# EAGLE board Pulsar 1.8 (EAGLE 5.11)
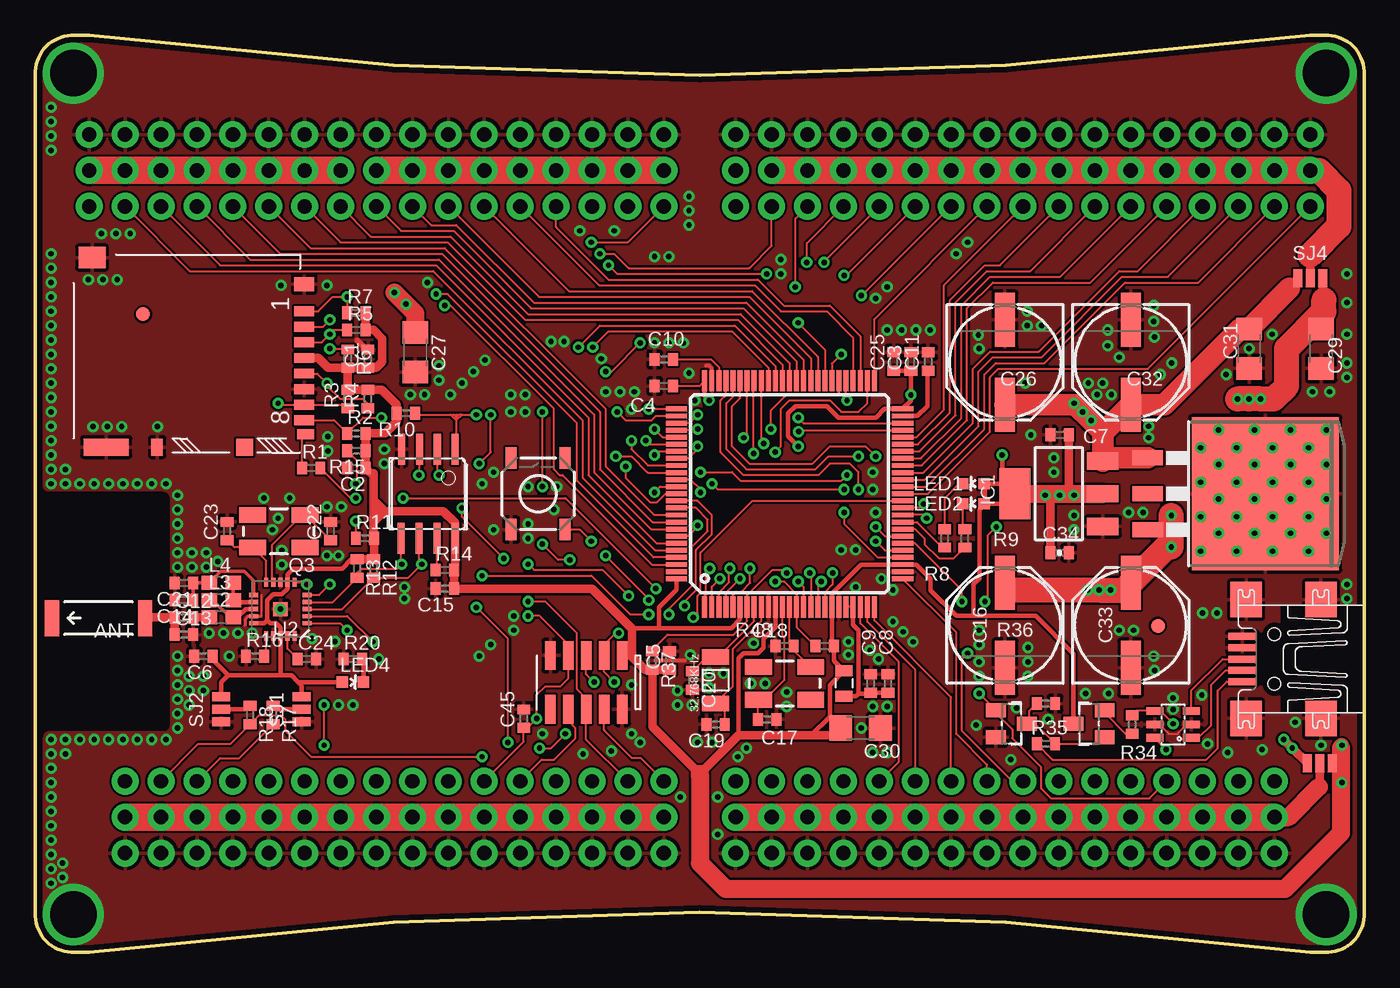
[diagram p6: board, top side]
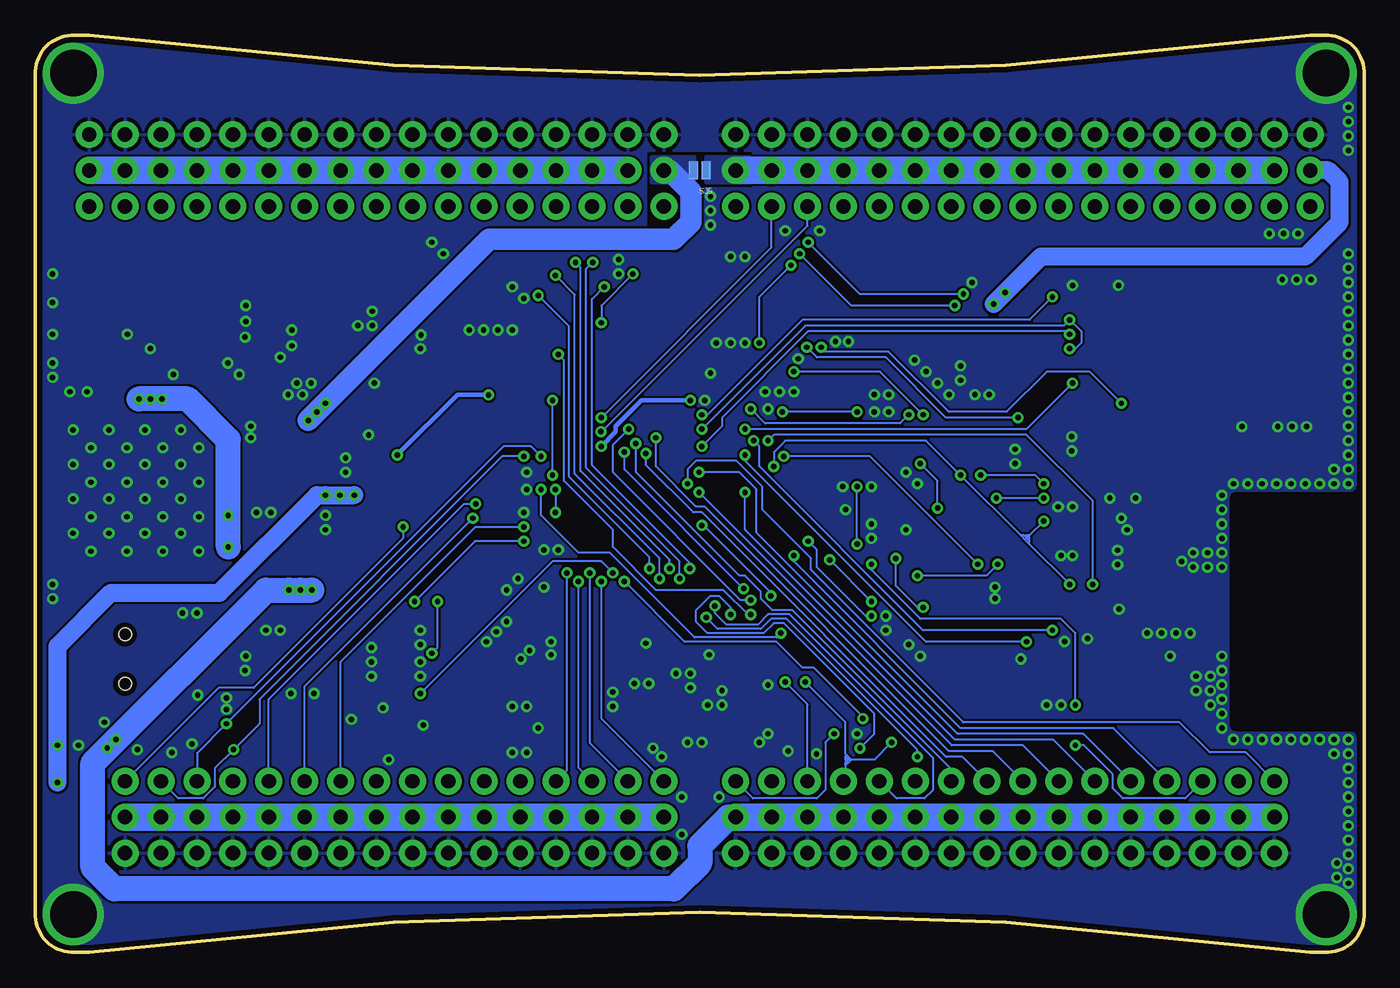
[diagram p7: board, bottom side, seen from below]

Size 93.98 x 64.82 mm. Coordinates in mm from the lower left corner, seen from the top.
Outline: 0,62.28 0,2.54 arc85 2.54,0 3.81,0 arc-15 90.17,0 91.44,0 arc85 93.98,2.54 93.98,62.28 arc85 91.44,64.82 90.17,64.82 arc-15 3.81,64.82 2.54,64.82 arc85 0,62.28
Copper layers (1*16): Top 0.035mm / dielectric 1.5mm / Bottom 0.035mm
Design rules "PDX (Production)": minimum track width 6mil, minimum drill 15mil, track to track 6mil, track to pad 6mil, pad to pad 4mil, via to via 6mil, smd to smd 4mil, copper to edge 15mil, drill to drill 6mil, minimum pad ring 10mil, minimum via ring 8mil, stop-mask expansion 4mil, vias tented up to drill 25mil, thermal gap 10mil
tRestrict: 7 lines
bRestrict: 10 lines

## Footprints (pad centres in the part's own frame; a part is rotated, then mirrored left to right if it is on the bottom)
ANTENNA-CHIP5 = smd 1.016 x 2.54: FEED -3.302,0; NC 3.302,0
C0402 = smd 0.7 x 0.9: 1 -0.65,0; 2 0.65,0
PANASONIC_E = smd 3.8 x 1.4: + 3,0; - -3,0
1206 = smd 1.6 x 1.8: 1 -1.4,0; 2 1.4,0
0402-CAP = smd 0.7 x 0.9: 1 -0.65,0; 2 0.65,0
#PULSAR-PTH = drill 1.016 pad 1.905 round: 5V1 -87.63,-55.88; 5V2 -85.09,-55.88; 5V3 -82.55,-55.88; 5V4 -80.01,-55.88; 5V5 -77.47,-55.88; 5V6 -74.93,-55.88; 5V7 -72.39,-55.88; 5V8 -69.85,-55.88; 5V9 -67.31,-55.88; 5V10 -64.77,-55.88; 5V11 -62.23,-55.88; 5V12 -59.69,-55.88; 5V13 -57.15,-55.88; 5V14 -54.61,-55.88; 5V15 -52.07,-55.88; 5V16 -49.53,-55.88; 5V/3.3V1 -44.45,-55.88; 5V/3.3V2 -41.91,-55.88; 5V/3.3V3 -39.37,-55.88; 5V/3.3V4 -36.83,-55.88; 5V/3.3V5 -34.29,-55.88; 5V/3.3V6 -31.75,-55.88; 5V/3.3V7 -29.21,-55.88; 5V/3.3V8 -26.67,-55.88; 5V/3.3V9 -24.13,-55.88; 5V/3.3V10 -21.59,-55.88; 5V/3.3V11 -19.05,-55.88; 5V/3.3V12 -16.51,-55.88; 5V/3.3V13 -13.97,-55.88; 5V/3.3V14 -11.43,-55.88; 5V/3.3V15 -8.89,-55.88; 5V/3.3V16 -6.35,-55.88; BOOT0 -82.55,-53.34; BOOT1 -85.09,-53.34; D0 -49.53,-12.7; D1 -41.91,-12.7; D2 -39.37,-12.7; D3 -36.83,-12.7; D4 -34.29,-12.7; D5 -31.75,-12.7; D6 -29.21,-12.7; D7 -26.67,-12.7; D8 -24.13,-12.7; D9 -21.59,-12.7; D10 -19.05,-12.7; D11 -16.51,-12.7; D12 -13.97,-12.7; D13 -11.43,-12.7; D14 -8.89,-12.7; D15 -6.35,-12.7; D16 -3.81,-12.7; D+ -11.43,-53.34; D- -8.89,-53.34; DAC1 -87.63,-53.34; DAC2 -6.35,-53.34; GND1 -87.63,-58.42; GND2 -85.09,-58.42; GND3 -82.55,-58.42; GND4 -80.01,-58.42; GND5 -77.47,-58.42; GND6 -74.93,-58.42; GND7 -72.39,-58.42; GND8 -69.85,-58.42; GND9 -67.31,-58.42; GND10 -64.77,-58.42; GND11 -62.23,-58.42; GND12 -59.69,-58.42; GND13 -57.15,-58.42; GND14 -54.61,-58.42; GND15 -52.07,-58.42; GND16 -49.53,-58.42; GND17 -44.45,-58.42; GND18 -41.91,-58.42; GND19 -39.37,-58.42; GND20 -36.83,-58.42; GND21 -34.29,-58.42; GND22 -31.75,-58.42; GND23 -29.21,-58.42; GND24 -26.67,-58.42; GND25 -24.13,-58.42; GND26 -21.59,-58.42; GND27 -19.05,-58.42; GND28 -16.51,-58.42; GND29 -13.97,-58.42; GND30 -11.43,-58.42; GND31 -8.89,-58.42; GND32 -6.35,-58.42; GND33 -3.81,-7.62; GND34 -6.35,-7.62; GND35 -8.89,-7.62; GND36 -11.43,-7.62; GND37 -13.97,-7.62; GND38 -16.51,-7.62; GND39 -19.05,-7.62; GND40 -21.59,-7.62; GND41 -24.13,-7.62; GND42 -26.67,-7.62; GND43 -29.21,-7.62; GND44 -31.75,-7.62; GND45 -34.29,-7.62; GND46 -36.83,-7.62; GND47 -39.37,-7.62; GND48 -41.91,-7.62; GND49 -44.45,-7.62; GND50 -49.53,-7.62; GND51 -52.07,-7.62; GND52 -54.61,-7.62; GND53 -57.15,-7.62; GND54 -59.69,-7.62; GND55 -62.23,-7.62; GND56 -64.77,-7.62; GND57 -67.31,-7.62; GND58 -69.85,-7.62; GND59 -72.39,-7.62; GND60 -74.93,-7.62; GND61 -77.47,-7.62; GND62 -80.01,-7.62; GND63 -82.55,-7.62; GND64 -85.09,-7.62; GND65 -87.63,-7.62; GND66 -90.17,-7.62; JTCK -57.15,-53.34; JTDI -52.07,-53.34; JTDO -59.69,-53.34; JTMS -54.61,-53.34; JTRST -49.53,-53.34; MCO -64.77,-53.34; NULL1 -44.45,-12.7; NULL2 -90.17,-12.7; PWR1 -44.45,-10.16; PWR2 -90.17,-10.16; RX1 -69.85,-53.34; RX2 -74.93,-53.34; RX3 -80.01,-53.34; SA -62.23,-53.34; T0 -87.63,-12.7; T1 -85.09,-12.7; T2 -82.55,-12.7; T3 -80.01,-12.7; T4 -77.47,-12.7; T5 -74.93,-12.7; T6 -72.39,-12.7; T7 -69.85,-12.7; T8 -67.31,-12.7; T9 -64.77,-12.7; T10 -62.23,-12.7; T11 -59.69,-12.7; T12 -57.15,-12.7; T13 -54.61,-12.7; T14 -52.07,-12.7; TA0 -16.51,-53.34; TA1 -19.05,-53.34; TA2 -21.59,-53.34; TA3 -24.13,-53.34; TA4 -26.67,-53.34; TA5 -29.21,-53.34; TA6 -31.75,-53.34; TA7 -34.29,-53.34; TA8 -36.83,-53.34; TA9 -39.37,-53.34; TA10 -41.91,-53.34; TA11 -44.45,-53.34; TX1 -67.31,-53.34; TX2 -72.39,-53.34; TX3 -77.47,-53.34; USBDISC -13.97,-53.34; VIN1 -49.53,-10.16; VIN2 -52.07,-10.16; VIN3 -54.61,-10.16; VIN4 -57.15,-10.16; VIN5 -59.69,-10.16; VIN6 -62.23,-10.16; VIN7 -64.77,-10.16; VIN8 -67.31,-10.16; VIN9 -69.85,-10.16; VIN10 -72.39,-10.16; VIN11 -74.93,-10.16; VIN12 -77.47,-10.16; VIN13 -80.01,-10.16; VIN14 -82.55,-10.16; VIN15 -85.09,-10.16; VIN16 -87.63,-10.16; VIN/5V1 -3.81,-10.16; VIN/5V2 -6.35,-10.16; VIN/5V3 -8.89,-10.16; VIN/5V4 -11.43,-10.16; VIN/5V5 -13.97,-10.16; VIN/5V6 -16.51,-10.16; VIN/5V7 -19.05,-10.16; VIN/5V8 -21.59,-10.16; VIN/5V9 -24.13,-10.16; VIN/5V10 -26.67,-10.16; VIN/5V11 -29.21,-10.16; VIN/5V12 -31.75,-10.16; VIN/5V13 -34.29,-10.16; VIN/5V14 -36.83,-10.16; VIN/5V15 -39.37,-10.16; VIN/5V16 -41.91,-10.16
SOT223 = smd 1.219 x 2.235: 1 -2.311,-3.099; 2 0,-3.099; 3 2.311,-3.099 | smd 3.6 x 2.2: 4 0,3.099
TO263-3 = smd 1.067 x 2.159: 1 -2.54,-5.791; 2 0,-5.791; 3 2.54,-5.791 | smd 10.8 x 10.41: TAB 0,2.54
FIDUCIAL-1X2 = smd 1 x 1: 1 0,0
0805 = smd 0.8 x 1.2: 1 -0.9,0; 2 0.9,0
0603 = smd 1.1 x 1: 1 -0.85,0; 2 0.85,0
LED-0603 = smd 0.8 x 0.8: A 0,-0.75; C 0,0.75
CRYSTAL-SMD-5X3 = smd 1.9 x 1.1: 1 -1.85,-1.15; 2 1.85,-1.15; 3 1.85,1.15; 4 -1.85,1.15
CM415 = smd 1.1 x 1.9: P$1 0,0; P$2 3.3,0
R0402 = smd 0.7 x 0.9: 1 -0.65,0; 2 0.65,0
TACTILE_SWITCH_SMD = smd 1.524 x 0.762: 1 -2.54,1.905; 2 2.54,1.905; 3 -2.54,-1.905; 4 2.54,-1.905
SJ_3 = smd 0.635 x 1.27: 1 -0.889,0; 2 0,0; 3 0.889,0
SJ_3_PASTE1&2 = smd 0.635 x 1.27: 1 -0.889,0; 2 0,0; 3 0.889,0
SJ_2S-NO = smd 0.635 x 1.27: 1 -0.45,0; 2 0.45,0
TQFP100 = smd 1.5 x 0.35: 1 -8,6; 2 -8,5.5; 3 -8,5; 4 -8,4.5; 5 -8,4; 6 -8,3.5; 7 -8,3; 8 -8,2.5; 9 -8,2; 10 -8,1.5; 11 -8,1; 12 -8,0.5; 13 -8,0; 14 -8,-0.5; 15 -8,-1; 16 -8,-1.5; 17 -8,-2; 18 -8,-2.5; 19 -8,-3; 20 -8,-3.5; 21 -8,-4; 22 -8,-4.5; 23 -8,-5; 24 -8,-5.5; 25 -8,-6; 51 8,-6; 52 8,-5.5; 53 8,-5; 54 8,-4.5; 55 8,-4; 56 8,-3.5; 57 8,-3; 58 8,-2.5; 59 8,-2; 60 8,-1.5; 61 8,-1; 62 8,-0.5; 63 8,0; 64 8,0.5; 65 8,1; 66 8,1.5; 67 8,2; 68 8,2.5; 69 8,3; 70 8,3.5; 71 8,4; 72 8,4.5; 73 8,5; 74 8,5.5; 75 8,6 | smd 0.35 x 1.5: 26 -6,-8; 27 -5.5,-8; 28 -5,-8; 29 -4.5,-8; 30 -4,-8; 31 -3.5,-8; 32 -3,-8; 33 -2.5,-8; 34 -2,-8; 35 -1.5,-8; 36 -1,-8; 37 -0.5,-8; 38 0,-8; 39 0.5,-8; 40 1,-8; 41 1.5,-8; 42 2,-8; 43 2.5,-8; 44 3,-8; 45 3.5,-8; 46 4,-8; 47 4.5,-8; 48 5,-8; 49 5.5,-8; 50 6,-8; 76 6,8; 77 5.5,8; 78 5,8; 79 4.5,8; 80 4,8; 81 3.5,8; 82 3,8; 83 2.5,8; 84 2,8; 85 1.5,8; 86 1,8; 87 0.5,8; 88 0,8; 89 -0.5,8; 90 -1,8; 91 -1.5,8; 92 -2,8; 93 -2.5,8; 94 -3,8; 95 -3.5,8; 96 -4,8; 97 -4.5,8; 98 -5,8; 99 -5.5,8; 100 -6,8
QFN20 = smd 1 x 1: 0 0,0 | smd 0.65 x 0.3: 1 -1.9,1; 2 -1.9,0.5; 3 -1.9,0; 4 -1.9,-0.5; 5 -1.9,-1; 11 1.9,-1; 12 1.9,-0.5; 13 1.9,0; 14 1.9,0.5; 15 1.9,1 | smd 0.3 x 0.65: 6 -1,-1.9; 7 -0.5,-1.9; 8 0,-1.9; 9 0.5,-1.9; 10 1,-1.9; 16 1,1.9; 17 0.5,1.9; 18 0,1.9; 19 -0.5,1.9; 20 -1,1.9
DUBLIB_SOIC8 = smd 0.5 x 2.2: 1 -1.905,-3.154; 2 -0.645,-3.154; 3 0.625,-3.154; 4 1.895,-3.154; 5 1.905,3.154; 6 0.635,3.154; 7 -0.635,3.154; 8 -1.905,3.154
SOT23-6L = smd 0.55 x 1.2: 1 -0.95,-1.3; 2 0,-1.3; 3 0.95,-1.3; 4 0.95,1.3; 5 0,1.3; 6 -0.95,1.3
STM32-JTAG-10P = smd 0.762 x 2.032: 1 0,0; 2 0,3.81; 3 1.27,0; 4 1.27,3.81; 5 2.54,0; 6 2.54,3.81; 7 3.81,0; 8 3.81,3.81; 9 5.08,0; 10 5.08,3.81
HIROSE-SDCARD-DM3B-DSF-PEJ@1 = smd 0.7 x 1.4: P$1 0,-0.7; P$2 1.1,-0.7; P$3 2.2,-0.7; P$4 3.3,-0.7; P$5 4.4,-0.7; P$6 5.5,-0.7; P$7 6.6,-0.7; P$8 7.7,-0.7 | smd 0.7 x 1.2: P$9 8.7,-0.6 | smd 1.2 x 1.2: P$10 9.6,-4.9 | smd 1.2 x 0.8: P$11 9.6,-11.1 | smd 1.2 x 3.2: P$12 9.6,-14.7 | smd 1.5 x 1.9: P$13 -3.8,-15.7 | smd 1 x 1.4: P$14 -1.9,-0.7
SOT23@1 = smd 1 x 1.4: 1 -0.95,-1.1; 2 0.95,-1.1; 3 0,1.1
DUBLIB_UX60-MB-5ST = smd 2 x 0.5: 1 2.25,1.6; 2 2.25,0.8; 3 2.25,0; 4 2.25,-0.8; 5 2.25,-1.6 | smd 2.2 x 2.5: M1 -3.3,-4.2; M2 -3.3,4.2; M3 2,4.2; M4 2,-4.2 | hole 0.9: 0,-1.75; 0,1.75

## Placement (x,y rotation side)
ANT  ANTENNA2SMD5  [ANTENNA-CHIP5]  4.47,23.62 180 top
C1  0.1uF  [C0402]  23.52,41.96 90 top
C2  0.1uF  [C0402]  22.71,34.24 180 top
C3  0.1uF  [C0402]  61.93,41.76 90 top
C4  0.1uF  [C0402]  44.45,40.03 180 top
C5  0.1uF  [C0402]  44.86,20.62 90 top
C6  0.1uF  [C0402]  11.89,20.93 180 top
C7  0.1uF  [C0402]  72.44,36.58 180 top
C8  220pF  [C0402]  60.3,19 90 top
C9  0.1uF  [C0402]  59.08,19 90 top
C10  2.2uF  [C0402]  44.45,41.91 180 top
C11  2.2uF  [C0402]  63.14,41.76 90 top
C12  1.5pF  [C0402]  10.52,23.67 0 top
C13  1pF  [C0402]  10.52,22.45 0 top
C14  4.7pF  [C0402]  10.52,24.89 180 top
C15  0.1uF  [C0402]  28.96,25.7 180 top
C16  300uF  [PANASONIC_E]  68.58,23.11 90 top
C17  12.5pF  [C0402]  51.77,16.46 0 top
C18  12.5pF  [C0402]  52.98,21.64 180 top
C19  18pF  [C0402]  48.11,16.1 180 top
C20  18pF  [C0402]  46.48,19.2 270 top
C21  0.0022uF  [C0402]  10.52,26.11 180 top
C22  12.5pF  [C0402]  20.88,29.77 90 top
C23  12.5pF  [C0402]  13.56,29.77 90 top
C24  0.033uF  [C0402]  19.2,20.73 0 top
C25  0.1uF  [C0402]  60.71,41.76 90 top
C26  300uF  [PANASONIC_E]  68.58,41.71 270 top
C27  47uF  [1206]  26.87,42.42 270 top
C29  10uF  [1206]  90.93,42.67 270 top
C30  10uF  [1206]  58.37,15.85 0 top
C31  10uF  [1206]  85.85,42.67 90 top
C32  300uF  [PANASONIC_E]  77.47,41.71 270 top
C33  300uF  [PANASONIC_E]  77.47,23.11 90 top
C34  .1uF  [0402-CAP]  72.44,28.24 0 top
C45  220pF  [C0402]  34.54,16.51 90 top
FP1  #PULSARPTH  [#PULSAR-PTH]  93.98,65.43 0 top
IC1  3.3v  [SOT223]  72.39,32.41 90 top
IC3  LM340S-12  [TO263-3]  84.45,32.41 270 top
INFO12  Evan Teitelman and Warren D Greenway  [%CC-BY-SA]  -2.54,-10.77 0 top  (outside the outline)
JP1  FIDUCIAL1X2  [FIDUCIAL-1X2]  7.62,45.11 0 top
JP2  FIDUCIAL1X2  [FIDUCIAL-1X2]  79.4,23.06 0 top
L1  10uH  [0805]  57.2,19 270 top
L2  3.9nH  [0603]  13.16,23.67 0 top
L3  8.2nH  [0603]  13.16,24.89 0 top
L4  2.7nH  [0603]  13.16,26.11 0 top
LED1  [LED-0603]  66.34,33.12 90 top
LED2  [LED-0603]  66.34,31.7 90 top
LED4  [LED-0603]  22.45,19.1 270 top
LOGO1  #LOGOA-THICK  [#LOGOA-THICK]  64.77,33.68 0 bottom
PULSARPART1  #PULSAR-PARTLABELS-BOTTOM  [#PULSAR-LABELS-BOTT]  93.98,65.43 0 top
Q1  8MHz  [CRYSTAL-SMD-5X3]  52.98,19 0 top
Q2  CM415  [CM415]  48.11,17.58 90 top
Q3  16MHz  [CRYSTAL-SMD-5X3]  17.22,29.77 180 top
R1  10K  [R0402]  19.51,34.24 0 top
R2  47K  [R0402]  22.71,36.68 0 top
R3  47K  [R0402]  22.1,39.12 90 top
R4  47K  [R0402]  23.52,39.12 90 top
R5  47K  [R0402]  22.71,43.99 0 top
R6  47K  [R0402]  22.1,41.96 270 top
R7  47K  [R0402]  22.71,45.21 0 top
R8  330  [R0402]  64.31,29.26 90 top
R9  330  [R0402]  65.74,29.26 90 top
R10  47K  [R0402]  26.21,38.1 180 top
R11  47K  [R0402]  23.32,29.26 0 top
R12  47K  [R0402]  23.93,27.13 270 top
R13  47K  [R0402]  22.76,27.13 270 top
R14  47K  [R0402]  28.96,27.03 0 top
R15  47K  [R0402]  22.71,35.46 180 top
R16  22K  [R0402]  15.54,20.93 0 top
R17  47K  [R0402]  16.81,16.76 270 top
R18  47K  [R0402]  15.19,16.76 270 top
R20  330  [R0402]  22.45,20.73 0 top
R34  1.5K  [R0402]  77.57,16.1 90 top
R35  10K  [R0402]  71.48,14.73 0 top
R36  36K  [R0402]  71.48,17.58 0 top
R37  47K  [R0402]  43.64,20.62 270 top
R48  100K  [R0402]  55.83,21.64 0 top
RSTSWITCH  SWITCH-MOMENTARY-2SMD  [TACTILE_SWITCH_SMD]  35.56,32.41 90 top
SJ1  [SJ_3]  18.85,17.17 90 top
SJ2  [SJ_3]  13.16,17.17 90 top
SJ3  [SJ_3_PASTE1&2]  90.83,13.36 180 top
SJ4  [SJ_3_PASTE1&2]  90.17,47.65 0 top
SJ5  SOLDERJUMPERNO  [SJ_2S-NO]  46.99,55.27 180 bottom
U1  STM32F205VG  [TQFP100]  53.34,32.41 90 top
U2  NRF24L01SMD  [QFN20]  17.33,24.26 180 top
U3  SST25VF080B  [DUBLIB_SOIC8]  27.79,32.41 180 top
U4  USBLC6-2  [SOT23-6L]  80.47,16.1 90 top
U5  STM32-JTAG-10P  [STM32-JTAG-10P]  41.5,20.98 180 top
U6  HIROSE-SDCARD-DM3B-DSF-PEJ  [HIROSE-SDCARD-DM3B-DSF-PEJ@1]  19.71,45.31 270 top
U$23  PMBT6428  [SOT23@1]  74.52,16.15 90 top
U$24  PMBT6428  [SOT23@1]  69.04,16.15 270 top
X2  MINI-USBUX60-MB-5ST  [DUBLIB_UX60-MB-5ST]  87.63,20.73 180 top

## Tracks (layer width: path | path; a pad name or v marks a point on that pad's centre or on a via)
3.3V  (via drill 0.38)
  Top 0.152: v92.4,11.99 92.4,12.67 SJ3.1 | 68.58,33.12 IC1.4 | 67.16,31.7 LED2.A | 69.24,31.85 69.8,32.41 | R37.2 | C4.1 46.96,40.03 U1.75 | 72.44,32.41 v72.44,32.31
  Top 0.178: 49.73,15.34 49.94,15.34
  Top 0.203: 47.4,13 47.4,12.6 | 46.58,13 46.58,12.5
  Top 0.305: 16.41,23.47 16.41,24.89 16.82,25.3 17.42,25.3 17.83,25.71 U2.7 17.83,26.72 18.24,27.13 21.69,27.13 22.34,27.78 R13.1 | U2.15 16.2,23.26 16.41,23.47 | 16.41,23.47 16.61,23.27 17.02,23.27 17.33,22.95 U2.18 17.33,19.57 | U$23.3 73.42,21.12 70.76,23.77 66.34,23.77 | C25.1 C3.1 v61.93,39.4 61.93,39 U1.50 60.05,38.4 59.44,37.8 56.79,37.8 55.98,38.61 53.75,38.61 53.24,38.1 53.24,36.47 v53.95,35.76 | U1.100 45.34,25.63 44.09,24.38 44.09,23.01 43.99,22.91 | U1.6 49.84,23.53 49.23,22.91 43.99,22.91 | U1.75 47.34,39.32 v47.65,39.01 | U1.11 52.34,22.98 51.51,22.15 51.51,21.54 51.11,21.13 50.09,21.13 49.73,20.78 49.73,15.34 | 54.86,15.34 56.19,16.66 56.19,18.88 L1.1 56.48,20.62 R48.2 56.34,21.78 U1.19 56.34,25.35 58.4,27.41 U1.28 62.3,27.41 63.3,26.42 63.3,25.6 65.13,23.77 66.34,23.77 | 46.99,12.6 47.4,13 | 43.99,22.91 42.22,22.91 42.22,22.86 | v68.38,35.15 68.38,32.72 68.78,32.31 69.19,32.31 IC1.4 68.78,31.9 | 24.89,31.19 24.08,30.38 | 24.18,31.9 24.69,31.39 | 24.18,31.9 24.08,32 | 24.08,30.58 24.49,30.99 24.49,31.39 24.08,31.8 | 23.93,31.8 24.08,31.8 | 24.08,31.8 24.18,31.9 | 13.65,19.57 17.33,19.57 | SJ2.3 13.16,19.08 13.65,19.57 | SJ1.3 18.85,18.85 18.59,19.1 | 17.33,19.57 18.12,19.57 18.59,19.1 | 13.65,19.57 12.54,20.69 C6.1 | 67.16,33.12 68.58,33.12 | 67.16,33.12 LED1.A | 67.16,31.7 69.09,31.7 69.24,31.85 | 67.16,31.7 67.16,33.12 | 67.16,31.7 66.75,31.29 66.75,26.42 66.34,26.01 66.34,23.77 | 18.59,19.1 LED4.A | 56.26,15.34 56.77,15.85 C30.1
  Top 0.457: 47.4,12.4 47.4,13 46.58,13 46.58,12.4
  Top 0.61: R6.2 R3.2 R4.2 24.5,39.77 25.56,38.7 R10.2 25.56,37.5 24.74,36.68 R2.2 R15.1 C2.1 23.72,33.87 23.93,33.87 23.93,31.8 23.93,31.19 | R6.2 C1.1 24.09,41.31 24.54,41.76 24.54,43.38 23.93,43.99 R5.2 R7.2 | R6.2 20.72,41.31 20.01,42.01 U6.P$4 | R13.1 R12.1 23.97,27.82 R11.2 23.93,29.3 23.93,31.19 | R37.2 43.12,19.97 42.22,20.88 | R37.2 C5.1 | 23.93,31.19 24.89,31.19 28.85,31.19 29.69,30.35 U3.8 29.69,27.11 R14.2 C15.1 39.37,25.7 42.22,22.86 42.22,20.88 | SJ3.1 92.4,14.05 v92.4,14.63 | 41.5,21.03 U5.1 42.11,20.98 42.22,20.88 | 47.4,13 49.73,15.34 54.86,15.34 56.26,15.34 | 46.99,12.6 46.58,13 43.64,15.95 R37.2 | C34.1 71.79,31.94 v71.42,32.31 | C7.1 73.09,32.67 v73.46,32.31
  Top 1.016: 92.35,14.63 92.35,14.43 92.4,14.48 v92.4,14.63
  Top 1.27: 46.99,12.6 46.99,6.3 48.82,4.47 88.39,4.47 92.35,8.43 92.35,14.43 | IC1.4 69.8,32.41 72.44,32.41 IC1.2
  Bottom 0.305: v68.38,35.15 64.13,39.4 v61.93,39.4 | v47.65,39.01 51.11,39.01 52.93,37.19 52.93,36.78 v53.95,35.76
  Bottom 1.27: v92.4,11.99 92.4,21.64 88.65,25.4 80.97,25.4 74.07,32.31 v73.46,32.31 v71.42,32.31
5V  (via drill 0.38)
  Top 0.152: 80.01,29.79 79.93,29.87 IC3.3
  Top 0.61: SJ3.3 89.94,13.39 v88.9,14.43 v88.29,15.04 | 91.13,46.13 91.06,46.2 SJ4.3 | C29.1 91.03,44.17 91.03,45.21
  Top 1.27: 69.09,25.6 C16.+ | C33.+ 77.47,26.01 77.06,25.6 | 80.34,29.46 80.01,29.79 | 80.01,28.65 v80.34,28.65
  Top 1.778: 69.09,25.6 v75.23,25.6 77.06,25.6 | v80.34,28.65 80.34,29.46 v80.34,30.89 | v85.04,39.12 v85.85,39.12 v86.66,39.12 87.58,39.12 88.49,40.03 88.49,42.67 91.03,45.21 91.13,45.31 91.13,46.13 | C33.+ 80.01,28.65
  Top 1.93: FP1.5V16 FP1.5V15 FP1.5V14 FP1.5V13 FP1.5V12 FP1.5V11 FP1.5V10 FP1.5V9 FP1.5V8 FP1.5V7 FP1.5V6 FP1.5V5 FP1.5V4 FP1.5V3 FP1.5V2 FP1.5V1
  Bottom 0.152: 89.92,13.36 89.92,13.41 v88.9,14.43
  Bottom 1.778: v86.66,39.12 83.21,39.12 80.34,36.25 v80.34,28.65 | v74.42,25.6 v75.23,25.6 v76.05,25.6 77.67,25.6 89.92,13.36 89.92,5.99 88.39,4.47 48.82,4.47 46.99,6.3 46.99,7.52 44.96,9.55 FP1.5V16
  Bottom 1.93: FP1.5V1 FP1.5V16
5V/3.3V
  Top 0.61: 90.78,11.68 90.83,11.73 SJ3.2
  Top 1.27: 90.78,11.68 88.65,9.55 FP1.5V/3.3V16
  Top 1.93: FP1.5V/3.3V16 FP1.5V/3.3V15 FP1.5V/3.3V14 FP1.5V/3.3V13 FP1.5V/3.3V12 FP1.5V/3.3V11 FP1.5V/3.3V10 FP1.5V/3.3V9 FP1.5V/3.3V8 FP1.5V/3.3V7 FP1.5V/3.3V6 FP1.5V/3.3V5 FP1.5V/3.3V4 FP1.5V/3.3V3 FP1.5V/3.3V2 FP1.5V/3.3V1
  Bottom 1.93: FP1.5V/3.3V1 FP1.5V/3.3V16
BOOT0  (via drill 0.38)
  Top 0.152: R17.2 14.42,13.72 13.06,13.72 FP1.BOOT0 | v20.42,14.63 v20.42,17.48 | U1.94 46.17,29.41 46.84,30.07 v46.84,30.18 | v41.96,25.2 40.13,27.03 35.26,27.03 v34.85,27.43
  Bottom 0.152: v34.85,27.43 34.85,27.03 31.39,23.57 21.44,23.57 20.42,22.56 v20.42,17.48 | v20.42,14.63 19.81,14.63 17.78,12.6 17.78,11.58 17.07,10.87 12.65,10.87 FP1.BOOT0 | v46.84,30.18 46.74,30.18 41.96,25.4 v41.96,25.2
BOOT1  (via drill 0.38)
  Top 0.152: U1.37 50.71,31.91 47.04,28.24 47.04,25.4 46.84,25.2 46.84,23.98 v46.53,23.67 | v31.6,13.82 19.51,13.82 17.68,15.65 17.68,16.46 17.37,16.76 15.84,16.76 R18.2 13.81,14.73 11.53,14.73 FP1.BOOT1
  Bottom 0.152: v46.53,23.67 45.72,22.86 42.67,22.86 41.96,23.57 40.84,23.57 31.6,14.33 v31.6,13.82
D0  (via drill 0.38)
  Top 0.152: U1.97 43.72,27.91 38.3,33.32 38.3,37.39 29.16,46.53 v28.35,46.53 | v39.32,50.19 41.91,50.19 FP1.D0
  Bottom 0.152: v39.32,50.19 35.66,46.53 v28.35,46.53
D1  (via drill 0.38)
  Top 0.152: v28.96,45.72 29.36,45.72 36.68,38.4 36.68,34.14 37.08,33.73 37.29,33.73 43.61,27.41 U1.98 | v39.93,49.38 40.95,49.38 41.96,48.36 50.49,48.36 52.07,49.94 FP1.D1
  Bottom 0.152: v39.93,49.38 36.27,45.72 v28.96,45.72
D2  (via drill 0.38)
  Top 0.152: 47.3,24.46 U1.1 47.34,25.19 47.45,25.3 47.45,26.86 47.44,26.87 v47.7,27.13 | v53.75,47.04 53.75,51.87 FP1.D2
  Bottom 0.152: v47.7,27.13 47.7,27.53 54.61,34.44 54.61,46.18 v53.75,47.04
D3  (via drill 0.38)
  Top 0.152: U1.2 47.84,25.84 v48.41,26.42 | v54.56,48.77 54.56,50.14 FP1.D3
  Bottom 0.152: v48.41,26.42 48.41,27.64 55.02,34.24 55.02,48.31 v54.56,48.77
D4  (via drill 0.38)
  Top 0.152: U1.3 48.34,25.43 49.07,26.16 49.07,27.08 v49.12,27.13 | v55.78,48.77 55.78,48.82 FP1.D4
  Bottom 0.152: v49.12,27.13 49.12,27.74 55.42,34.04 55.42,48.41 v55.78,48.77
D5  (via drill 0.38)
  Top 0.152: U1.4 48.84,25.42 v49.84,26.42 | v57.2,47.85 57.35,47.85 FP1.D5
  Bottom 0.152: v49.84,26.42 49.84,27.84 55.83,33.83 55.83,46.48 v57.2,47.85
D6  (via drill 0.38)
  Top 0.152: v50.55,27.13 50.55,26.11 49.94,25.5 49.58,25.5 49.34,25.26 U1.5 | v58.42,46.43 58.47,46.43 FP1.D6
  Bottom 0.152: v50.55,27.13 50.55,27.94 56.24,33.63 56.24,44.25 v58.42,46.43
D7
  Top 0.152: U1.51 59.34,44.76 FP1.D7
D8
  Top 0.152: U1.46 62.32,36.41 64.26,38.35 64.26,47.14 FP1.D8
D9
  Top 0.152: U1.45 62.43,35.91 64.67,38.15 64.67,46.08 67.16,48.56 68.22,48.56 FP1.D9
D10
  Top 0.152: U1.44 62.54,35.41 65.07,37.95 65.07,45.92 67.31,48.16 70.36,48.16 FP1.D10
D11
  Top 0.152: U1.43 62.65,34.91 65.48,37.74 65.48,45.72 67.51,47.75 72.49,47.75 FP1.D11
D12
  Top 0.152: U1.42 62.71,34.41 65.89,37.59 65.89,45.52 67.72,47.35 74.62,47.35 FP1.D12
D13
  Top 0.152: U1.41 62.82,33.91 66.29,37.39 66.29,41.25 67.51,42.47 70.97,42.47 76.66,48.16 77.98,48.16 FP1.D13
D14
  Top 0.152: U1.40 62.93,33.41 66.7,37.19 66.7,41.05 67.72,42.06 71.17,42.06 76.86,47.75 80.11,47.75 FP1.D14
D15
  Top 0.152: U1.39 63.04,32.91 67.11,36.98 67.11,40.84 67.92,41.66 71.37,41.66 77.06,47.35 82.24,47.35 FP1.D15
D16
  Top 0.152: U1.38 63.14,32.41 67.51,36.78 67.51,40.64 68.12,41.25 78.69,41.25 FP1.D16
D+  (via drill 0.38)
  Top 0.152: R34.2 77.87,17.05 U4.4 79.57,17.05 v80.47,16.15 | v58.22,35.05 56.08,35.05 55.17,34.14 50.29,34.14 48.87,35.56 48.87,38.81 49.34,39.28 U1.71
  Bottom 0.152: v58.22,35.05 58.93,35.76 60.86,35.76 v80.47,16.15 82.55,14.07 FP1.D+
D-  (via drill 0.38)
  Top 0.152: U1.70 49.84,39.17 49.28,38.61 49.28,35.76 50.49,34.54 54.97,34.54 56.19,35.76 58.73,35.76 v59.44,35.05 | 78.86,15.15 U4.6 79.17,15.12 v79.96,14.33
  Bottom 0.152: v59.44,35.05 60.96,35.05 78.13,17.88 78.13,16.15 v79.96,14.33 81.28,13 81.28,11.68 82.09,10.87 83.87,10.87 FP1.D-
DAC1  (via drill 0.38)
  Top 0.152: v47.85,33.12 48.26,32.72 v57.2,32.72 | U1.29 59.57,27.91 57.2,30.28 v57.2,31.09
  Bottom 0.152: v57.2,32.72 v57.2,31.09 | v47.85,33.12 47.85,34.14 47.24,34.75 44.4,34.75 42.57,32.92 42.57,31.29 39.12,27.84 39.12,27.03 28.35,16.26 13.06,16.26 10.92,14.12 8.38,14.12 FP1.DAC1
DAC2  (via drill 0.38)
  Top 0.152: v59.44,29.06 60.08,28.41 U1.30 | v67.16,24.79 67.36,24.99 67.36,29.46 v67.97,30.07
  Bottom 0.152: v67.97,30.07 67.97,29.26 78.54,18.69 81.03,18.69 FP1.DAC2 | v67.16,24.79 62.89,29.06 v59.44,29.06
FLASH_CS  (via drill 0.38)
  Top 0.152: v53.95,44.5 55.84,42.61 U1.58 | v40.34,41.05 40.74,41.05 v42.77,43.08 | v40.54,48.56 41.15,47.96 v51.71,47.96 | 29.36,38 26.96,38 R10.1 | 29.36,38 29.57,38 | 29.57,38 29.77,38 | 29.77,38 29.97,38 | 30.18,38 29.97,38 | 30.18,38 v31.19,38 | U3.1 29.77,35.56 29.77,37.59 | 29.77,37.8 29.77,38 | 29.77,37.59 29.77,37.8 | 29.77,37.59 30.18,38 | 29.36,38 29.77,37.59 | 29.57,38 29.77,37.8 | 29.77,37.8 29.97,38
  Bottom 0.152: v42.77,43.08 42.77,46.33 v40.54,48.56 | v40.34,41.05 34.24,41.05 v31.19,38 | v53.95,44.5 53.95,45.72 v51.71,47.96
GND  (via drill 0.38, 3.3 pad 0.25)
  Top 0.152: C1.2 23.52,42.62 23.47,42.67 | 15.55,23.77 15.53,23.76 U2.14 15.98,23.76 16,23.77 16,25.25 | U4.5 79.3,16.1 79.35,16.05 79.55,16.05 80.16,15.44 80.77,15.44 81.43,16.1 U4.2
  Top 0.229: 14.83,23.11 14.83,23.52 15.09,23.77 15.11,23.76 U2.14
  Top 0.279: 43.89,20.62 45.92,20.62
  Top 0.292: 47.45,41.47 47.65,41.47 47.85,41.26 47.85,40.84
  Top 0.305: 47.85,40.84 47.84,40.83 U1.74
  Top 0.381: 23.47,42.67 23.37,42.67 22.76,43.28
  other vias: 17.37,47.14 20.62,47.14 75.84,43.99 75.84,42.88 79.1,45.72 79.1,44.6 75.49,40.23 76.1,39.42 74.47,40.23 75.08,39.42 46.23,53.44 46.23,51.41 44.81,49.17 43.79,49.17 62.28,43.99 61.26,43.99 52.73,48.97 52.73,47.96 42.16,38.4 41.35,39.62 42.37,39.62 59.03,21.34 59.64,20.73 17.33,24.26 17.43,27.41 17.43,28.42 20.62,28.04 15.34,22.56 14.33,22.56 13.31,22.56 12.29,22.56 21.44,28.04 45.42,17.48 46.43,17.48 46.33,21.03 79.15,19.91 83.57,23.98 79.1,20.93 76.66,22.76 89.1,16.26 75.9,18.29 70.21,19.51 70.21,20.52 69.39,17.27 66.75,19.51 66.75,20.52 66.75,21.74 66.75,22.76 70.21,21.54 68.99,13.61 66.55,16.05 71.63,16.46 74.27,18.29 53.14,18.39 53.14,17.37 58.01,25.81 60.66,25.6 59.84,26.42 58.01,28.45 43.79,43.08 31.8,41.86 30.99,41.05 30.18,40.23 29.36,39.42 34.85,30.28 34.85,29.26 32.41,29.87 34.85,32.92 36.88,32.92 59.23,32.72 44.81,43.08 45.82,43.08 57.51,21.03 57.51,21.95 60.66,23.37 61.37,22.66 62.08,21.95 46.63,39.01 50.8,21.84 50.6,19 51.61,19 40.34,39.62 36.47,43.18 37.39,43.18 40.03,41.96 91.29,2.67 2.69,2.67 1.12,15.04 2.13,15.04 3.15,15.04 4.17,15.04 5.18,15.04 6.2,15.04 7.21,15.04 8.23,15.04 9.25,15.04 10.87,17.48 10.06,15.85 10.06,16.87 10.06,18.9 10.06,19.91 10.06,20.93 10.06,17.88 10.87,19.51 11.89,19.51 10.87,18.49 10.06,27.23 10.06,28.24 10.06,29.26 10.06,30.28 10.06,31.29 10.06,32.31 9.25,33.12 8.23,33.12 7.21,33.12 6.2,33.12 5.18,33.12 4.17,33.12 3.15,33.12 2.13,33.12 1.12,33.12 4.07,37.16 5.09,37.16 6.1,37.16 8.64,37.16 11.07,27.23 11.07,28.24 12.09,27.23 11.89,18.49 1.12,14.02 1.12,13 1.12,11.99 1.12,10.97 1.12,9.96 1.12,8.94 1.12,7.92 1.12,6.91 2.13,14.02 1.12,34.14 2.13,34.14 1.12,35.15 1.12,36.17 1.12,37.19 1.12,38.2 1.12,39.22 1.12,40.23 1.12,41.25 1.12,42.27 1.12,43.28 1.12,44.3 1.12,45.31 1.12,46.33 1.12,47.35 1.12,48.36 1.12,49.38 1.12,56.69 1.12,57.71 1.12,58.72 17.17,30.68 19.57,22.17 13.72,20.93 12.09,28.24 12.9,27.64 2.69,62.15 91.29,62.15 59.44,31.09 57,28.45 6.71,50.8 1.12,59.74 1.12,5.89 1.12,4.88 1.93,5.28 1.93,6.3 91.31,36.93 91.31,34.49 91.31,32.05 91.31,29.62 90.04,35.66 90.04,33.22 90.04,30.78 90.04,28.35 88.77,36.93 88.77,34.49 88.77,32.05 88.77,29.62 87.5,35.66 87.5,33.22 87.5,30.78 87.5,28.35 84.96,35.66 84.96,33.22 84.96,30.78 84.96,28.35 83.69,36.93 83.69,34.49 83.69,32.05 83.69,29.62 82.42,35.66 82.42,33.22 82.42,30.78 82.42,28.35 86.23,36.93 86.23,34.49 86.23,32.05 86.23,29.62 76.66,42.06 85.85,42.67 84.23,40.84 91.54,39.62 87.48,43.69 90.32,39.62 79.15,43.48 66.7,43.64 71.17,44.3 70.15,44.3 70.15,45.31 66.75,42.67 73.46,30.89 73.46,29.87 77.32,31.09 82.55,23.98 17.98,32.11 16.15,32.11 20.62,31.5 21.64,31.5 20.68,36.45 20.68,35.43 42.16,18.9 42.16,15.44 47.65,18.69 47.65,19.71 48.67,19.71 46.84,14.83 47.85,14.83 45.42,18.49 5.69,50.8 4.67,50.8 3.76,47.55 4.78,47.55 5.79,47.55 46.23,40.94 33.63,38.2 34.65,39.42 33.63,39.42 34.65,38.2 26.11,25.81 26.11,24.99 80.47,17.98 80.47,17.17 82.5,18.19 60.25,17.37 59.23,17.37 58.42,15.85 59.23,14.12 60.25,14.12 33.83,23.77 32.21,21.74 31.39,20.93 33.83,22.76 60.25,47.04 59.44,46.23 63.3,43.99 60.25,43.99 82.91,14.73 77.67,22.76 27.74,47.35 46.23,52.43 65.94,50.19 65.13,49.38 59.23,33.93 16.76,29.87 24.69,35.56 24.69,34.54 38.51,51 26.52,39.42 27.53,39.42 28.55,41.45 28.55,40.44 92.76,26.01 70.41,36.58 92.76,24.99 78.33,31.09 90.93,14.63 86.77,14.33 84.33,14.12 21.19,21.97 24.28,20.73 21.44,17.48 22.45,17.48 92.76,40.64 92.76,41.66 72.03,34.95 72.03,33.93 92.76,47.96 92.76,45.92 92.76,43.69 40.94,51 31.6,33.12 32.41,33.93 36.68,31.29 70,40.23 80.37,41.66 79.55,40.84 78.74,36.37 78.74,37.19 35.86,15.44 38.73,14.02 40.74,14.22 42.77,14.83 49.68,13.82 50.29,14.43 45.62,10.97 48.26,10.97 48.26,8.33
  pour Bottom: -2.54,67.97 96.52,67.97 96.72,-2.95 -2.54,-3.15
  pour Top: -1.27,66.7 95.25,66.7 95.25,-1.88 -1.27,-1.88
JTCK  (via drill 0.38)
  Top 0.152: U1.76 v43.39,38.41 v43.38,38.4 | v31.19,24.38 33.43,22.15 v33.43,14.83 | 39.12,20.32 38.96,20.47 U5.5 38.96,19.66 v39.52,19.1 | v31.39,34.54 32.21,35.36 v32.21,38 | v33.12,27.84 30.18,30.78 v30.18,31.39
  Bottom 0.152: v39.52,19.1 36.68,16.26 36.68,14.02 | v43.38,38.4 42.37,37.39 32.82,37.39 v32.21,38 | v33.12,27.84 33.12,25.91 31.6,24.38 v31.19,24.38 | v33.43,14.83 34.65,13.61 36.27,13.61 | 36.68,13.61 36.68,13.41 | 36.68,13.21 36.68,13.41 | 36.68,13.21 36.68,12.24 FP1.JTCK | 36.68,13.61 36.68,13.82 | 36.68,14.02 36.68,13.82 | 36.27,13.61 36.47,13.61 | 36.47,13.61 36.68,13.61 | 36.27,13.61 36.47,13.82 | 36.47,13.82 36.68,14.02 | 36.27,13.61 36.47,13.41 | 36.47,13.41 36.68,13.21 | 36.47,13.82 36.68,13.61 | 36.47,13.41 36.68,13.61 | 36.47,13.61 36.68,13.41 | 36.47,13.61 36.68,13.82 | v30.18,31.39 30.18,33.32 v31.39,34.54
JTDI  (via drill 0.38)
  Top 0.152: U1.77 43.91,37.91 43.59,37.59 41.76,37.59 v41.15,38.2 | v35.87,32.92 v35.87,38.2 | v34.85,24.79 36.07,24.79 38.3,22.56 38.3,18.59 38.96,17.93 U5.6 38.96,15.04 FP1.JTDI | v37.8,27.74 36.98,27.74 v35.87,28.85
  Bottom 0.152: v35.87,38.2 v41.15,38.2 | v35.87,28.85 v35.87,32.92 | v34.85,24.79 v37.8,27.74
JTDO  (via drill 0.38)
  Top 0.152: U1.89 46.83,31.91 47.85,30.89 47.85,29.57 46.74,28.45 46.74,25.6 45.92,24.79 v45.92,24.49 | U5.8 37.69,16.36 38.2,15.85 38.2,15.14 36.68,13.61 35.81,13.61 FP1.JTDO
  Bottom 0.152: v45.92,24.49 45.92,23.98 45.11,23.16 42.88,23.16 42.16,23.88 40.64,23.88 30.48,13.72 30.48,11.48 31.09,10.87 33.07,10.87 FP1.JTDO
JTMS  (via drill 0.38)
  Top 0.152: U5.3 40.13,20.88 | U1.72 48.84,39.39 48.46,39.01 48.46,35.36 50.09,33.73 55.37,33.73 56.19,34.54 57.61,34.54 58.22,33.93 v58.22,32.72 | U5.3 40.23,21.74 41.05,22.56 v41.25,22.56 | v40.95,19.1 40.23,19.81 U5.3
  Bottom 0.152: v40.95,19.1 39.37,17.53 FP1.JTMS | v58.22,32.72 58.22,30.89 55.58,28.24 53.34,28.24 47.35,22.25 41.55,22.25 v41.25,22.56
JTRST  (via drill 0.38)
  Top 0.152: U5.4 40.23,15.7 42.22,13.72 42.82,13.72 FP1.JTRST | U1.90 46.72,31.41 47.55,30.58 47.55,29.77 46.43,28.65 46.43,25.91 44.81,24.28 v44.81,23.88 | v35.66,14.43 36.47,14.43 v37.49,15.44
  Bottom 0.152: v35.66,14.43 34.65,15.44 34.65,16.87 41.05,23.27 41.76,23.27 42.47,22.56 46.43,22.56 47.24,23.37 47.24,24.18 46.23,25.2 45.62,25.2 44.81,24.38 v44.81,23.88 | v37.49,15.44 38.1,14.83 38.1,11.48 38.71,10.87 43.23,10.87 FP1.JTRST
LED0
  Top 0.152: R8.1 64.15,28.61 62.35,30.41 U1.34
LED1
  Top 0.152: R9.1 64.96,27.84 63.91,27.84 62.89,28.85 62.89,29.26 62.24,29.91 U1.33
MCO  (via drill 0.38)
  Top 0.152: v51.51,35.97 51.34,36.14 U1.67
  Bottom 0.152: v51.51,35.97 51.51,33.93 44.2,26.62 43.79,26.62 42.67,25.5 42.67,24.99 41.86,24.18 40.44,24.18 29.21,12.95 FP1.MCO
N$1
  Top 0.152: U1.12 52.84,22.39 52.98,22.25 52.98,19.25 51.58,17.85 Q1.1 | Q1.1 51.13,17.66 | C17.1 51.12,17.83 Q1.1
N$2
  Top 0.152: U1.22 U1.21
  Top 0.305: C8.1 C9.1 59.02,18.29 58.22,18.29 | 58.22,18.29 58.22,22.76 57.84,23.14 U1.22 | 58.22,18.29 58.03,18.1 L1.2
N$3
  Top 0.152: Q1.3 53.63,21.35 C18.1 53.34,21.94 U1.13
N$4
  Top 0.152: U$23.1 75.15,14.73 R35.2 70.31,16.55 | U$24.3 70.31,16.15 70.31,16.55 | R36.1 70.31,17.06 70.31,16.55
N$6
  Top 0.305: U1.49 62.4,37.91 63.09,38.61 63.09,41.06 C11.1
N$7
  Top 0.152: U1.73 48.34,41.37 47.8,41.91 C10.1
N$8
  Top 0.152: U1.8 50.84,23.41 48.36,20.93 48.16,20.93 Q2.P$2 47.51,20.88 C20.1
N$9
  Top 0.152: 48.54,18.01 Q2.P$1 | 48.54,18.01 49.33,18.8 49.33,21.44 51.34,23.45 U1.9 | C19.1 48.76,17.79 48.54,18.01
N$10
  Top 0.152: R8.2 64.31,32.11 65.33,33.12 LED1.C
N$11
  Top 0.152: R1.1 18.86,36.36 U6.P$9
N$12
  Top 0.152: R9.2 65.59,30.05 LED2.C
N$13
  Top 0.305: LED4.C 23.2,20.63 R20.2
N$17
  Top 0.61: L2.1 C12.2
N$18
  Top 0.254: L3.2 L4.2
  Top 0.305: U2.12 14.14,24.76 L3.2
N$19
  Top 0.61: ANT.FEED 7.82,23.67 C12.1 C13.1
N$20
  Top 0.254: L3.1 12.55,24.89 13.77,23.67 L2.2
  Top 0.305: U2.13 14.86,24.26 14.28,23.67 L2.2
N$21
  Top 0.254: C14.1 C21.1 L4.1 13.12,26.92 14.78,26.92 15.43,26.28 U2.11
N$23
  Top 0.152: U2.16 16.33,21.07 R16.2
N$24
  Top 0.152: U2.19 17.83,21.45 C24.1
N$25
  Top 0.152: 75.92,17.1 U$23.2 75.62,16.93 77.1,15.45 R34.1
N$26
  Top 0.152: U2.9 16.76,26.22 16.76,28.81 18.87,30.92 Q3.1 C22.1
N$27
  Top 0.152: U2.10 16.33,27.66 Q3.3 14.06,28.62 C23.1
N$28  (via drill 0.38)
  Top 0.152: v22.66,33.12 22.76,33.22 22.76,34.76 R15.2 | v27.13,33.73 27.16,33.77 U3.3
  Bottom 0.152: v27.13,33.73 23.27,33.73 v22.66,33.12
N$29
  Top 0.152: R14.1 28.42,27.14 U3.7
N$30
  Top 0.305: SJ1.2 17.06,17.17 R17.1
N$31
  Top 0.305: SJ2.2 14.95,17.17 R18.1
N$38
  Top 0.152: U4.1 82.26,15.15 83.16,16.05 83.16,18.9 84.19,19.93 X2.2
RF24_CE  (via drill 0.38)
  Top 0.152: U2.1 21.55,23.26 v22.05,22.76 | U1.81 43.44,35.91 v43.18,36.17
  Bottom 0.152: v43.18,36.17 42.77,35.76 42.77,34.34 31.19,22.76 v22.05,22.76
RF24_CS  (via drill 0.38)
  Top 0.152: 19.25,23.77 U2.2 22.07,23.76 v23.88,21.95 | U1.82 44.05,35.41 v43.79,35.15
  Bottom 0.152: v23.88,21.95 30.99,21.95 43.79,34.75 v43.79,35.15
RF24_IRQ  (via drill 0.38)
  Top 0.152: v19.2,26.01 19.06,26.16 U2.6 | v42.16,36.17 42.16,35.56 43.31,34.41 U1.84
  Bottom 0.152: v42.16,36.17 41.76,36.58 23.88,36.58 19.2,31.9 v19.2,26.01
RX1  (via drill 0.38)
  Top 0.152: v50.09,36.37 50.34,36.62 U1.69
  Bottom 0.152: v50.09,36.37 50.09,34.34 47.24,31.5 46.63,31.5 29.36,14.22 26.26,14.22 FP1.RX1
RX2  (via drill 0.38)
  Top 0.152: v43.79,32.51 44.19,32.91 U1.87
  Bottom 0.152: v43.79,32.51 43.79,29.87 28.96,15.04 22,15.04 FP1.RX2
RX3  (via drill 0.38)
  Top 0.152: v52.02,36.98 52.02,38.3 53.14,39.42 56.69,39.42 56.84,39.57 U1.56 | v43.38,24.89 43.38,24.99 v40.34,28.04
  Bottom 0.152: v52.02,36.98 53.14,35.86 53.14,33.93 44.09,24.89 v43.38,24.89 | v40.34,28.04 40.34,27.64 28.55,15.85 17.73,15.85 FP1.RX3
SA  (via drill 0.38)
  Top 0.152: R48.1 53.84,22.98 U1.14 53.84,25.31 52.93,26.21 v52.32,26.21 | 37.87,29.87 RSTSWITCH.3 38.51,29.87 v39.32,29.06 | v34.85,23.77 35.66,23.77 37.69,21.74 U5.7 37.69,19.35 37.13,18.8 36.07,18.8 35.46,18.19 v35.46,16.51 34.81,15.86 C45.1 34.54,14.88 FP1.SA
  Bottom 0.152: v52.32,26.21 48.06,21.95 41.55,21.95 39.73,20.12 38.91,20.12 35.46,16.66 v35.46,16.51 | v34.85,23.77 35.26,23.77 38.71,27.23 38.71,28.45 v39.32,29.06
SDIO_CK  (via drill 0.38)
  Top 0.152: U1.80 44.36,36.41 v43.79,36.98 | U6.P$5 19.95,40.91 v20.62,40.23 20.62,40.03 21.54,39.12 23.16,39.12 23.47,38.81 23.47,38.52 R4.1
  Bottom 0.152: v20.62,40.23 23.88,36.98 v43.79,36.98
SDIO_CMD  (via drill 0.38)
  Top 0.152: U1.83 46.19,34.91 46.84,35.56 v46.84,35.76 | U6.P$3 20.25,43.11 v20.83,43.69 21.13,43.99 R5.1
  Bottom 0.152: v20.83,43.69 21.03,43.89 39.32,43.89 45.41,37.8 45.41,37.19 v46.84,35.76
SDIO_D0  (via drill 0.38)
  Top 0.152: R3.1 21.85,38.71 U6.P$7 17.27,38.71 v17.17,38.81 | U1.65 52.34,41.44 49.48,44.3 39.93,44.3 v38.41,42.77
  Bottom 0.152: v17.17,38.81 19.41,41.05 22.45,41.05 25.3,38.2 29.36,38.2 33.63,42.47 38.1,42.47 v38.41,42.77
SDIO_D1  (via drill 0.38)
  Top 0.152: U6.P$8 21.12,37.61 R2.1 23.18,37.8 v24.49,37.8 | U1.66 51.84,41.33 49.28,43.89 40.54,43.89 v39.42,42.77
  Bottom 0.152: v24.49,37.8 29.57,37.8 33.83,42.06 38.71,42.06 v39.42,42.77
SDIO_D2  (via drill 0.38)
  Top 0.152: U1.78 46.25,37.41 v46.84,38 | U6.P$1 20.02,45.31 21.03,46.33 v22.05,46.33 v22.06,46.32 R7.1
  Bottom 0.152: v22.05,46.33 23.67,44.7 39.73,44.7 46.43,38 v46.84,38
SDIO_D3  (via drill 0.38)
  Top 0.152: U1.79 46.77,36.91 v46.84,36.98 | v20.83,44.7 20.34,44.21 U6.P$2 | v20.83,42.67 22.04,42.67 R6.1
  Bottom 0.152: v20.83,42.67 20.42,42.67 20.02,43.08 20.02,43.89 v20.83,44.7 21.23,44.3 39.52,44.3 v46.84,36.98
SDIO_DETECT  (via drill 0.38)
  Top 0.152: R1.2 22.29,32.11 v22.66,32.11 | U1.52 58.84,38.82 58.22,38.2 57,38.2 56.19,39.01 53.34,39.01 52.73,38.4 52.73,35.76 v52.32,35.36 | v43.89,25.7 37.49,32.11 v26.01,32.11
  Bottom 0.152: v43.89,25.7 52.32,34.14 v52.32,35.36 | v22.66,32.11 v26.01,32.11
SPI_MISO  (via drill 0.38)
  Top 0.152: U2.5 20.07,25.26 v20.83,26.01 | U1.88 44.58,32.41 43.97,31.8 43.48,31.8 41.76,33.53 v41.76,34.34 | v22.66,30.48 v22.67,30.47 R11.1 | U3.2 28.43,33.85 v28.55,33.73
  Bottom 0.152: v20.83,26.01 23.67,28.85 | 23.67,28.85 23.98,29.16 | 23.98,29.16 24.28,29.46 | v41.76,34.34 41.76,35.36 40.95,36.17 30.99,36.17 v28.55,33.73 24.28,29.46 | 23.98,29.16 23.67,29.46 | 23.67,29.46 v22.66,30.48 | 23.67,29.46 23.88,29.46 | 24.08,29.46 23.88,29.46 | 24.08,29.46 24.28,29.46 | 23.67,29.26 23.67,29.46 | 23.67,29.06 23.67,29.26 | 23.67,28.85 23.67,29.06 | 23.67,29.06 24.08,29.46 | 23.67,29.26 23.88,29.46
SPI_MOSI  (via drill 0.38)
  Top 0.152: U1.57 56.34,41.61 v57,42.27 | v31.6,26.62 39.32,26.62 42.06,23.88 v43.38,23.88 | U2.4 21.04,24.76 R13.2 22.76,26.82 23.06,27.13 25.6,27.13 v25.91,27.43 25.88,27.46 U3.5
  Bottom 0.152: v57,42.27 56.59,41.86 56.59,33.32 53.14,29.87 53.14,28.65 50.09,25.6 45.31,25.6 43.59,23.88 v43.38,23.88 | v31.6,26.62 26.72,26.62 v25.91,27.43
SPI_SCK  (via drill 0.38)
  Top 0.152: U2.3 21.71,24.26 R12.2 26.38,26.48 v27.33,27.43 27.15,27.61 U3.6 | U1.85 43.31,33.91 42.16,35.05 v41.05,35.05
  Bottom 0.152: v27.33,27.43 34.95,35.05 v41.05,35.05
T0
  Top 0.152: U1.96 43.83,28.41 38.71,33.53 38.71,37.59 28.14,48.16 10.92,48.16 FP1.T0
T1
  Top 0.152: U1.95 43.94,28.91 39.12,33.73 39.12,37.8 28.35,48.56 13.06,48.56 FP1.T1
T2
  Top 0.152: U1.93 43.55,29.91 39.52,33.93 39.52,38 28.55,48.97 15.19,48.97 FP1.T2
T3
  Top 0.152: U1.92 43.66,30.41 39.93,34.14 39.93,38.2 28.75,49.38 17.32,49.38 FP1.T3
T4
  Top 0.152: U1.91 43.77,30.91 40.34,34.34 40.34,38.4 28.96,49.78 19.46,49.78 FP1.T4
T5
  Top 0.152: U1.64 52.84,41.55 49.68,44.7 34.65,44.7 29.16,50.19 21.59,50.19 FP1.T5
T6
  Top 0.152: U1.63 53.34,41.66 49.89,45.11 34.85,45.11 29.36,50.6 23.72,50.6 FP1.T6
T7
  Top 0.152: U1.62 53.84,41.77 50.09,45.52 35.05,45.52 29.57,51 25.86,51 FP1.T7
T8
  Top 0.152: U1.61 54.34,41.88 50.29,45.92 35.26,45.92 29.77,51.41 27.99,51.41 FP1.T8
T9
  Top 0.152: U1.60 54.84,41.98 50.49,46.33 35.61,46.33 FP1.T9
T10
  Top 0.152: U1.59 55.34,42.09 50.7,46.74 37.74,46.74 FP1.T10
T11
  Top 0.152: U1.54 57.84,43.46 55.98,45.31 52.73,45.31 50.9,47.14 39.88,47.14 FP1.T11
T12
  Top 0.152: U1.53 58.34,43.56 56.19,45.72 52.93,45.72 51.11,47.55 40.54,47.55 36.83,51.26 FP1.T12
T13  (via drill 0.38)
  Top 0.152: v53.98,36.81 54.08,36.91 U1.47
  Bottom 0.152: v53.98,36.81 53.92,36.81 39.37,51.36 FP1.T13
T14  (via drill 0.38)
  Top 0.152: U1.48 54.33,37.41 v53.95,37.8
  Bottom 0.152: v53.95,37.8 41.91,49.83 FP1.T14
TA0  (via drill 0.38)
  Top 0.152: U1.36 62.55,31.41 v62.84,31.7
  Bottom 0.152: v62.84,31.7 63.65,31.7 77.47,17.88 FP1.TA0
TA1  (via drill 0.38)
  Top 0.152: v63.04,30.68 62.82,30.91 U1.35
  Bottom 0.152: v63.04,30.68 74.93,18.8 FP1.TA1
TA2  (via drill 0.38)
  Top 0.152: v59.44,30.07 60.1,29.41 U1.32
  Bottom 0.152: v59.44,30.07 62.84,30.07 72.39,20.52 FP1.TA2
TA3  (via drill 0.38)
  Top 0.152: U1.31 62.23,28.91 65.53,25.6 v65.53,24.79 | v65.94,21.13 65.53,20.73 65.53,15.65 69.09,12.09 FP1.TA3
  Bottom 0.152: v65.53,24.79 65.53,21.54 v65.94,21.13
TA4
  Top 0.152: U1.26 65.13,22.62 65.13,15.44 67.31,13.26 FP1.TA4
TA5
  Top 0.152: U1.25 59.34,23.46 64.77,18.03 FP1.TA5
TA6
  Top 0.152: U1.24 58.84,23.35 62.23,19.96 FP1.TA6
TA7
  Top 0.152: U1.23 58.34,23.24 61.06,20.52 61.06,13.46 FP1.TA7
TA8  (via drill 0.38)
  Top 0.152: U1.18 55.84,25.46 56.39,26.01 v56.39,26.82
  Bottom 0.152: v56.39,26.82 56.39,12.85 FP1.TA8
TA9  (via drill 0.38)
  Top 0.152: U1.17 55.34,25.98 v55.58,26.21
  Bottom 0.152: v55.58,26.21 55.58,13.06 FP1.TA9
TA10  (via drill 0.38)
  Top 0.152: U1.16 54.84,26.74 v54.76,26.82
  Bottom 0.152: v54.76,26.82 54.76,14.78 FP1.TA10
TA11  (via drill 0.38)
  Top 0.152: U1.15 54.34,25.82 v53.95,26.21
  Bottom 0.152: v53.95,26.21 53.95,16.51 FP1.TA11
TX1  (via drill 0.38)
  Top 0.152: v50.8,35.26 50.8,40.37 U1.68
  Bottom 0.152: v50.8,35.26 50.8,34.44 47.45,31.09 46.84,31.09 29.57,13.82 28.4,13.82 FP1.TX1
TX2  (via drill 0.38)
  Top 0.152: v47.04,32.51 47.04,32.72 46.35,33.41 U1.86
  Bottom 0.152: v47.04,32.51 29.16,14.63 24.13,14.63 FP1.TX2
TX3  (via drill 0.38)
  Top 0.152: v57.4,33.73 57,33.32 49.89,33.32 49.28,33.93 v47.04,33.93 | v57.4,39.01 57.34,39.08 U1.55
  Bottom 0.152: v57.4,33.73 v57.4,39.01 | 46.63,33.93 v47.04,33.93 44.2,33.93 42.98,32.72 42.98,29.67 28.75,15.44 19.86,15.44 FP1.TX3
USB5V
  Top 0.152: R35.1 71.94,13.61 82.8,13.61 83.62,14.43 83.62,18.49 84.25,19.13 X2.1
USBDISC  (via drill 0.38)
  Top 0.152: R37.1 43.64,21.39 44.7,22.45 49.38,22.45 50.34,23.42 U1.7 50.34,25.24 52.12,27.03 52.93,27.03 v53.14,26.82 | v66.75,18.29 66.95,18.08 66.96,18.08 U$24.1 67.94,16.9 69.09,15.75 69.09,15.14 71.12,13.11 71.12,11.58 71.83,10.87 78.79,10.87 FP1.USBDISC
  Bottom 0.152: v66.75,18.29 57.4,27.64 53.95,27.64 v53.14,26.82
USBP3
  Top 0.152: X2.3 83.97,20.73 81.77,18.52 U4.3
V+  (via drill 0.38)
  Top 0.61: 88.7,46.94 88.7,47.07 SJ4.1
  Top 1.27: 75.49,36.78 75.49,36.73 75.49,36.58 | IC1.3 75.72,34.95
  Top 1.524: 75.49,36.58 IC1.3 | 75.49,36.78 v74.68,37.59 73.56,38.71 C26.+ | 75.72,34.95 IC3.1 | 75.49,36.73 C32.+ 79.85,38.71 85.22,44.07 C31.2 85.85,44.09 88.7,46.94
  Bottom 1.27: v74.68,37.59 v74.07,38.2 v73.46,38.81
  Bottom 1.524: v74.68,37.59 61.87,50.39 48.84,50.39 47.62,51.61 47.62,53.77 49.12,55.27
  pour Bottom (no thermals): 50.39,56.24 47.35,56.24 47.35,54.41 50.39,54.41
VIN  (via drill 0.38)
  Top 1.27: C27.1 26.87,45.16 v26.21,45.82 v25.4,46.63
  Top 1.93: FP1.PWR2 FP1.VIN16 FP1.VIN15 FP1.VIN14 FP1.VIN13 FP1.VIN12 FP1.VIN11 FP1.VIN10 | FP1.VIN9 FP1.VIN8 FP1.VIN7 FP1.VIN6 FP1.VIN5 FP1.VIN4 FP1.VIN3 FP1.VIN2 FP1.VIN1
  Bottom 1.27: v26.21,45.82 22.86,49.17 4.17,49.17 1.73,51.61 1.73,54.46 2.54,55.27 FP1.PWR2
  Bottom 1.93: FP1.VIN16 FP1.VIN1
  pour Bottom (no thermals): 46.53,56.24 43.48,56.24 43.48,54.41 46.53,54.41
VIN/5V
  Top 0.61: 90.17,49.28 SJ4.2
  Top 1.778: 90.17,49.28 92.2,51.31 92.2,53.85 90.78,55.27 FP1.VIN/5V1
  Top 1.93: FP1.VIN/5V16 FP1.VIN/5V15 FP1.VIN/5V14 FP1.VIN/5V13 FP1.VIN/5V12 FP1.VIN/5V11 FP1.VIN/5V10 FP1.VIN/5V9 FP1.VIN/5V8 FP1.VIN/5V7 FP1.VIN/5V6 FP1.VIN/5V5 FP1.VIN/5V4 FP1.VIN/5V3 FP1.VIN/5V2 FP1.VIN/5V1
  Bottom 1.93: FP1.VIN/5V16 FP1.VIN/5V1

## Text on the board
tTest: 5V | VIN | Reset | 5V | 3.3V
bTest: Pygmy Pulsar | Version 1 | Designed By Evan Teitelman and Warren D Greenway
Document: Pygmy Pulsar Version 1.8 | Standard Grid: 50mil | Routing Grids: 8mil / 4mil | Edge Via Grid: 10mil | Via Drill: 15mil | Standard Trace Width: 6mil | Horizontal Edge Curve: 15 | Equator | Prime Meridian
_tsilk: - | + | Unregulated | Unregulated / 5V | 5V | 5V / 3.3V | + | -